# Altium schematic sheet 12-DPLL-01.SchDoc
size B; SheetNumber: 12; SheetTotal: 16
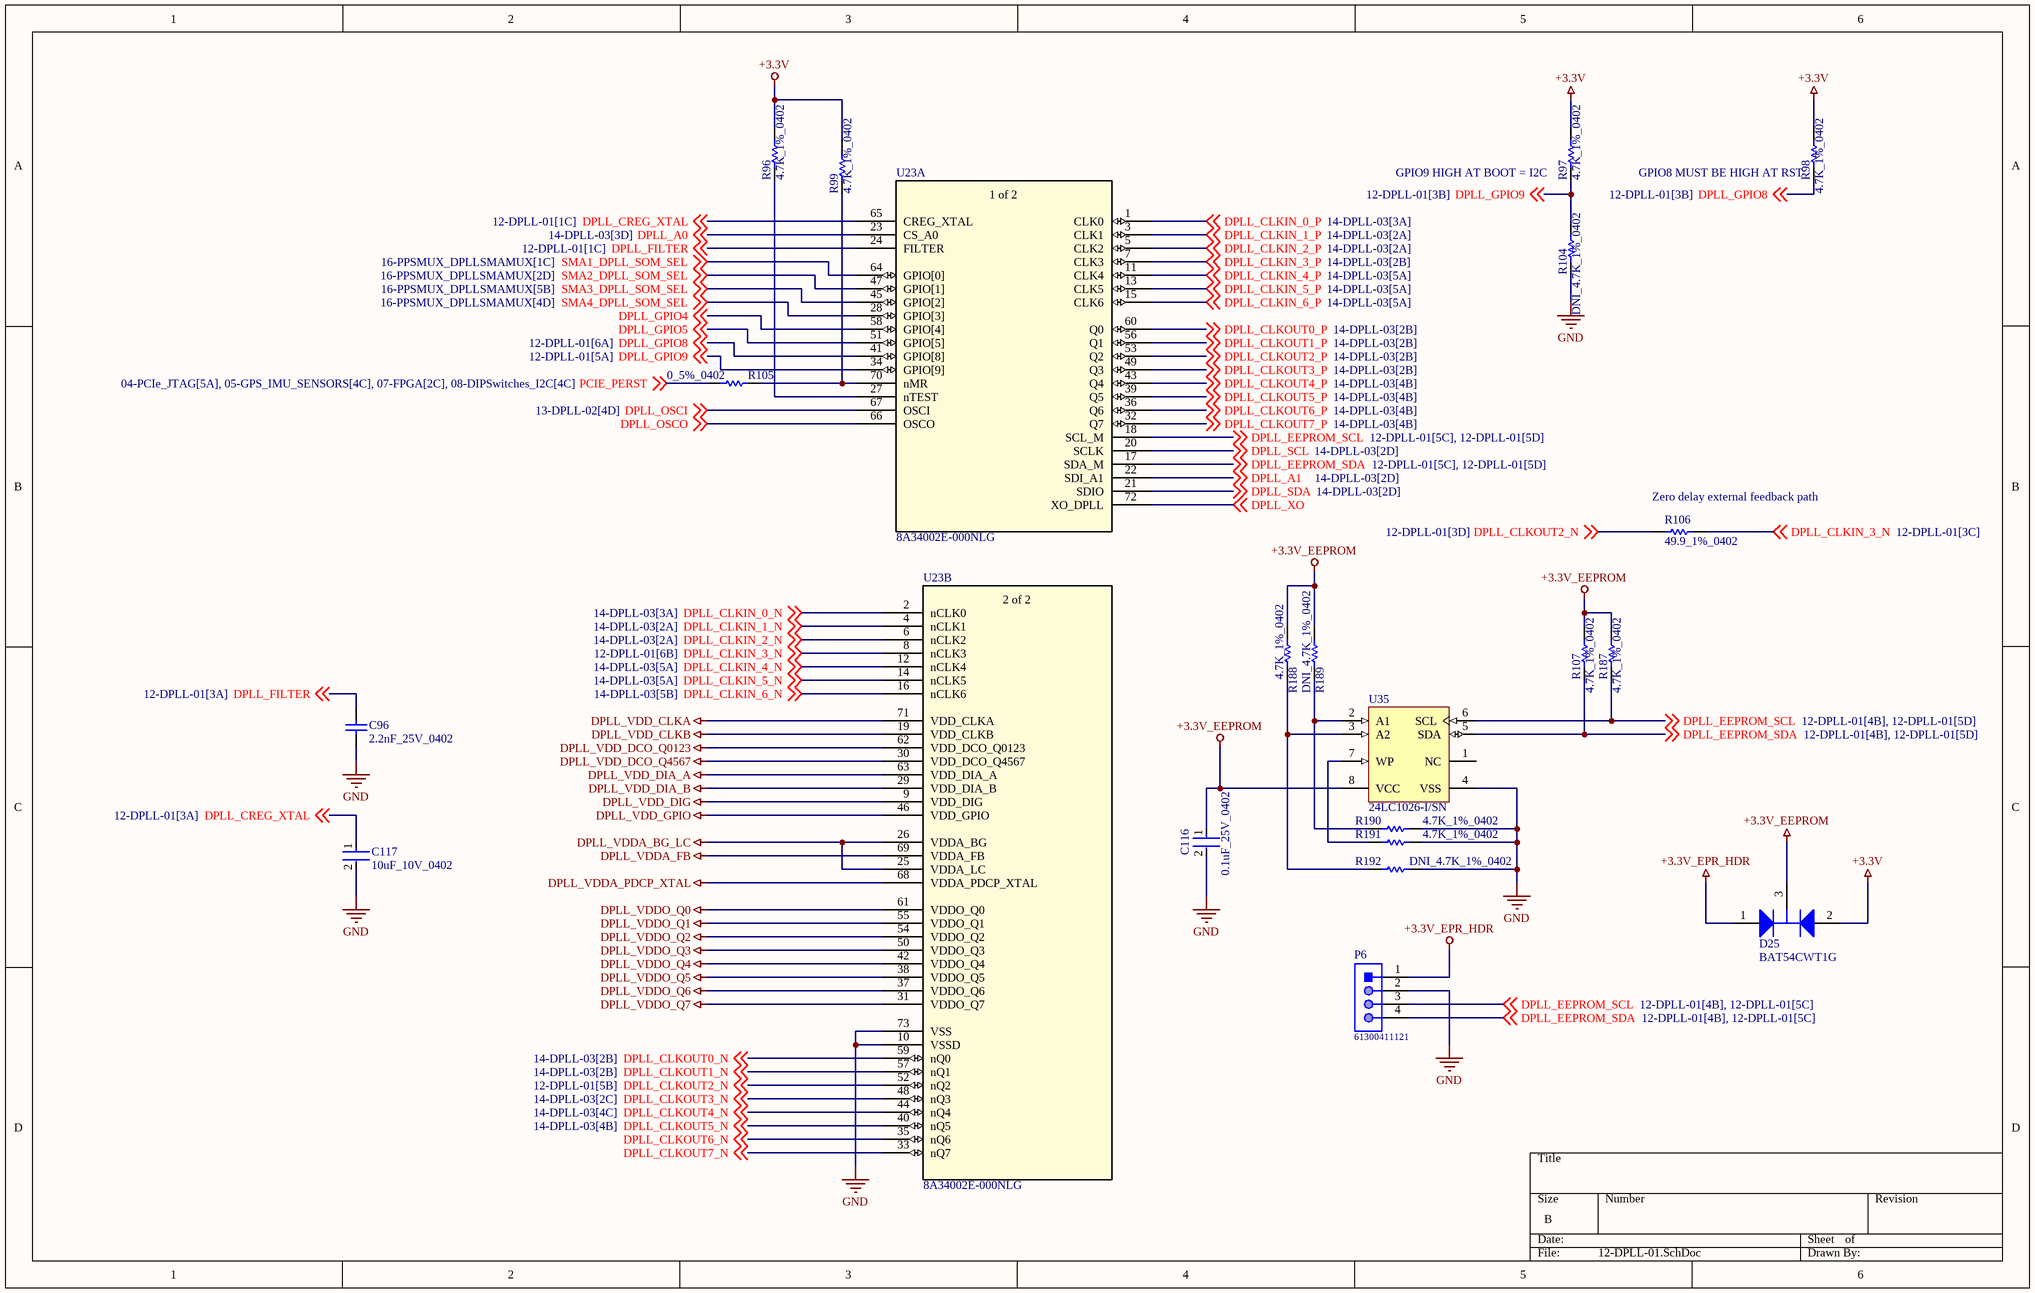
[diagram p0: 12-DPLL-01.SchDoc]

## Parts
C96  2.2nF_25V_0402  [CAPC1005X56X25LL10T15]
C116  0.1uF_25V_0402  [FP-0402-L_1_0_1-W_0_5_0_1-IPC_C]
C117  10uF_10V_0402  [FP-CL05A106MP5NUNC-MFG]
D25  BAT54CWT1G  [ONSC-SOT-323-3-419-04_V]
P6  61300411121  [61300411121]
R96  4.7K_1%_0402  [RESC1005X40X25NL10T10]
R97  4.7K_1%_0402  [RESC1005X40X25NL10T10]
R98  4.7K_1%_0402  [RESC1005X40X25NL10T10]
R99  4.7K_1%_0402  [RESC1005X40X25NL10T10]
R104  DNI_4.7K_1%_0402  [RESC1005X40X25NL10T10]  (no BOM)
R105  0_5%_0402  [RESC1005X40X25LL10T10]
R106  49.9_1%_0402  [RESC1005X40X25NL10T10]
R107  4.7K_1%_0402  [RESC1005X40X25NL10T10]
R187  4.7K_1%_0402  [RESC1005X40X25NL10T10]
R188  4.7K_1%_0402  [RESC1005X40X25NL10T10]
R189  DNI_4.7K_1%_0402  [RESC1005X40X25NL10T10]  (no BOM)
R190  4.7K_1%_0402  [RESC1005X40X25NL10T10]
R191  4.7K_1%_0402  [RESC1005X40X25NL10T10]
R192  DNI_4.7K_1%_0402  [RESC1005X40X25NL10T10]  (no BOM)
U23  8A34002E-000NLG  [QFN_2E-000NLG_REN]  (parts A,B of 2)
U35  24LC1026-I/SN  [MCHP-SOIC-SN8_N]

## Nets
+3.3V: D25.2(A2) R96.2 R97.1 R98.1 R99.2
+3.3V_EEPROM: C116.1 D25.3(K) R107.1 R187.1 R188.2 R189.2 U35.8(VCC)
+3.3V_EPR_HDR: D25.1(A1) P6.1
DPLL_VDD_CLKA: U23.71(VDD_CLKA)
DPLL_VDD_CLKB: U23.19(VDD_CLKB)
DPLL_VDD_DCO_Q0123: U23.62(VDD_DCO_Q0123)
DPLL_VDD_DCO_Q4567: U23.30(VDD_DCO_Q4567)
DPLL_VDD_DIA_A: U23.63(VDD_DIA_A)
DPLL_VDD_DIA_B: U23.29(VDD_DIA_B)
DPLL_VDD_DIG: U23.9(VDD_DIG)
DPLL_VDD_GPIO: U23.46(VDD_GPIO)
DPLL_VDDA_BG_LC: U23.25(VDDA_LC) U23.26(VDDA_BG)
DPLL_VDDA_FB: U23.69(VDDA_FB)
DPLL_VDDA_PDCP_XTAL: U23.68(VDDA_PDCP_XTAL)
DPLL_VDDO_Q0: U23.61(VDDO_Q0)
DPLL_VDDO_Q1: U23.55(VDDO_Q1)
DPLL_VDDO_Q2: U23.54(VDDO_Q2)
DPLL_VDDO_Q3: U23.50(VDDO_Q3)
DPLL_VDDO_Q4: U23.42(VDDO_Q4)
DPLL_VDDO_Q5: U23.38(VDDO_Q5)
DPLL_VDDO_Q6: U23.37(VDDO_Q6)
DPLL_VDDO_Q7: U23.31(VDDO_Q7)
GND: C96.1 C116.2 C117.2 P6.2 R104.2 R190.1 R191.1 R192.2 U23.10(VSSD) U23.73(VSS) U35.4(VSS)
DPLL_A0: U23.23(CS_A0) ; off-sheet DPLL_A0
DPLL_A1: U23.22(SDI_A1) ; off-sheet DPLL_A1
DPLL_CLKIN_0_N: U23.2(nCLK0) ; off-sheet DPLL_CLKIN_0_N
DPLL_CLKIN_0_P: U23.1(CLK0) ; off-sheet DPLL_CLKIN_0_P
DPLL_CLKIN_1_N: U23.4(nCLK1) ; off-sheet DPLL_CLKIN_1_N
DPLL_CLKIN_1_P: U23.3(CLK1) ; off-sheet DPLL_CLKIN_1_P
DPLL_CLKIN_2_N: U23.6(nCLK2) ; off-sheet DPLL_CLKIN_2_N
DPLL_CLKIN_2_P: U23.5(CLK2) ; off-sheet DPLL_CLKIN_2_P
DPLL_CLKIN_3_N: R106.2 U23.8(nCLK3) ; off-sheet DPLL_CLKIN_3_N
DPLL_CLKIN_3_P: U23.7(CLK3) ; off-sheet DPLL_CLKIN_3_P
DPLL_CLKIN_4_N: U23.12(nCLK4) ; off-sheet DPLL_CLKIN_4_N
DPLL_CLKIN_4_P: U23.11(CLK4) ; off-sheet DPLL_CLKIN_4_P
DPLL_CLKIN_5_N: U23.14(nCLK5) ; off-sheet DPLL_CLKIN_5_N
DPLL_CLKIN_5_P: U23.13(CLK5) ; off-sheet DPLL_CLKIN_5_P
DPLL_CLKIN_6_N: U23.16(nCLK6) ; off-sheet DPLL_CLKIN_6_N
DPLL_CLKIN_6_P: U23.15(CLK6) ; off-sheet DPLL_CLKIN_6_P
DPLL_CLKOUT0_N: U23.59(nQ0) ; off-sheet DPLL_CLKOUT0_N
DPLL_CLKOUT0_P: U23.60(Q0) ; off-sheet DPLL_CLKOUT0_P
DPLL_CLKOUT1_N: U23.57(nQ1) ; off-sheet DPLL_CLKOUT1_N
DPLL_CLKOUT1_P: U23.56(Q1) ; off-sheet DPLL_CLKOUT1_P
DPLL_CLKOUT2_N: R106.1 U23.52(nQ2) ; off-sheet DPLL_CLKOUT2_N
DPLL_CLKOUT2_P: U23.53(Q2) ; off-sheet DPLL_CLKOUT2_P
DPLL_CLKOUT3_N: U23.48(nQ3) ; off-sheet DPLL_CLKOUT3_N
DPLL_CLKOUT3_P: U23.49(Q3) ; off-sheet DPLL_CLKOUT3_P
DPLL_CLKOUT4_N: U23.44(nQ4) ; off-sheet DPLL_CLKOUT4_N
DPLL_CLKOUT4_P: U23.43(Q4) ; off-sheet DPLL_CLKOUT4_P
DPLL_CLKOUT5_N: U23.40(nQ5) ; off-sheet DPLL_CLKOUT5_N
DPLL_CLKOUT5_P: U23.39(Q5) ; off-sheet DPLL_CLKOUT5_P
DPLL_CLKOUT6_N: U23.35(nQ6) ; off-sheet DPLL_CLKOUT6_N
DPLL_CLKOUT6_P: U23.36(Q6) ; off-sheet DPLL_CLKOUT6_P
DPLL_CLKOUT7_N: U23.33(nQ7) ; off-sheet DPLL_CLKOUT7_N
DPLL_CLKOUT7_P: U23.32(Q7) ; off-sheet DPLL_CLKOUT7_P
DPLL_CREG_XTAL: C117.1 U23.65(CREG_XTAL) ; off-sheet DPLL_CREG_XTAL
DPLL_EEPROM_SCL: P6.3 R187.2 U23.18(SCL_M) U35.6(SCL) ; off-sheet DPLL_EEPROM_SCL
DPLL_EEPROM_SDA: P6.4 R107.2 U23.17(SDA_M) U35.5(SDA) ; off-sheet DPLL_EEPROM_SDA
DPLL_FILTER: C96.2 U23.24(FILTER) ; off-sheet DPLL_FILTER
DPLL_GPIO4: U23.58(GPIO[4]) ; off-sheet DPLL_GPIO4
DPLL_GPIO5: U23.51(GPIO[5]) ; off-sheet DPLL_GPIO5
DPLL_GPIO8: R98.2 U23.41(GPIO[8]) ; off-sheet DPLL_GPIO8
DPLL_GPIO9: R97.2 R104.1 U23.34(GPIO[9]) ; off-sheet DPLL_GPIO9
DPLL_OSCI: U23.67(OSCI) ; off-sheet DPLL_OSCI
DPLL_OSCO: U23.66(OSCO) ; off-sheet DPLL_OSCO
DPLL_SCL: U23.20(SCLK) ; off-sheet DPLL_SCL
DPLL_SDA: U23.21(SDIO) ; off-sheet DPLL_SDA
DPLL_XO: U23.72(XO_DPLL) ; off-sheet DPLL_XO
PCIE_PERST: R105.1 ; off-sheet PCIE_PERST
SMA1_DPLL_SOM_SEL: U23.64(GPIO[0]) ; off-sheet SMA1_DPLL_SOM_SEL
SMA2_DPLL_SOM_SEL: U23.47(GPIO[1]) ; off-sheet SMA2_DPLL_SOM_SEL
SMA3_DPLL_SOM_SEL: U23.45(GPIO[2]) ; off-sheet SMA3_DPLL_SOM_SEL
SMA4_DPLL_SOM_SEL: U23.28(GPIO[3]) ; off-sheet SMA4_DPLL_SOM_SEL
NetR96_1: R96.1 U23.27(nTEST)
NetR99_1: R99.1 R105.2 U23.70(nMR)
NetR188_1: R188.1 R192.1 U35.3(A2)
NetR189_1: R189.1 R190.2 U35.2(A1)
NetR191_2: R191.2 U35.7(WP)

Not connected (* = marked no-connect by the designer): U35 1(NC)

## Notes on the sheet
- (near R97) GPIO9 HIGH AT BOOT = I2C
- (near R98) GPIO8 MUST BE HIGH AT RST
- (near R106) Zero delay external feedback path
- (in symbol 8A34002E-000NLG, part A) 1 of 2
- (in symbol 8A34002E-000NLG, part B) 2 of 2

## Library data of the parts
C96 = CMP-2008-02907-1: Manufacturer: AVX Interconnect / Elco; Part Number: 04025C222JAT2A
C116 = CMP-2008-02519-2: General Purpose Ceramic Capacitor, 0402, 100nF, 10%, X7R, 15%, 25V; Package Quantity: 1; Capacitance: 100nF; Min Operating Temperature: -55°C; Voltage: 25V; Voltage Rating: 25V; Construction: Flat; Max Operating Temperature: 125°C; Radiation Hardening: No; Depth: 0.5mm; Thickness: 0.022inch; Voltage Rating (DC): 25V; Number of Pins: 2; Lead Free: Lead Free; Series: -; REACH SVHC: No SVHC; Length: 1mm; Dielectric: X7R; RoHS Compliant: Yes; Mount: Surface Mount; Packaging: Tape and Reel; Case/Package: 0402; Case Code (Imperial): 0402; Termination: SMD/SMT; Width: 0.02inch; Case Code (Metric): 1005; Tolerance: 10%
C117 = CMP-13271-000002-1: CAP CER 10UF 10V X5R 0402; Manufacturer Part Number: CL05A106MP5NUNC; Manufacturer: Samsung; Temperature Coefficient: 15%; Tolerance: 20%; Material: Ceramic; Octopart: https://octopart.com/cl05a106mp5nunc-samsung-22457395; Voltage Rating: 10V; RoHS: TRUE; Value: 10uF; Height: 0.7mm; Digikey Description: CAP CER 10UF 10V X5R 0402; Automotive: No; Package: CL05A106MP5NUNC; Device Class L1: Passive Components; Capacitance: 10uF; Temperature Range High: +85°C; ComponentLink2Description: Datasheet; Device Class L2: Capacitors; Temperature Characteristic: X5R; Temperature: -55°C to +85°C; ComponentLink2URL: http://www.samsungsem.com/kr/support/product-search/mlcc/__icsFiles/afieldfile/2019/05/10/19-CL05A106MP5NUNC.pdf; Device Class L3: Ceramic Capacitors; Category: Cap; Temperature Range Low: -55°C; Ipc Land Pattern Name: CAPC10050X50; Lead Free: Yes
D25 = CMP-1055-00557-1: Dual Series Cathode Schottky Barrier Diodes, 3-Pin SOT-323, Pb-Free, Tape and Reel; Manufacturer: On Semiconductor; Configuration: Common Cathode; IFSM Max (A): 0.6; trr Max (ns): 5; ComponentLink2Description: Datasheet; Packing: Tape and Reel; ComponentLink3Description: Package Specification; Mounting Technology: Surface Mount; PartNumber: BAT54CWT1G; PackageVersion: Rev. N, 11/2008; RoHS: TRUE; ComponentLink3URL: http://www.onsemi.com/pub_link/Collateral/419-04.PDF; ComponentLink2URL: http://www.onsemi.cn/pub_link/Collateral/BAT54CWT1-D.PDF; PackageReference: SOT-323-3-419-04; ComponentLink1URL: http://www.onsemi.com/; ComponentLink1Description: Manufacturer URL; DatasheetVersion: Rev. 7; PackageDescription: 3-Pin Small Outline Transistor, Body 2 x 1.25 mm, Pitch 0.65 mm
P6 = CMP-1502-01064-1: THT Vertical Pin Header WR-PHD, Pitch 2.54 mm, Single Row, 4 pins; Manufacturer: Wurth Elektronik; Withstanding Voltage: 500VAC; Rated Current: 3A; Working Voltage: 250VAC; Pin Number: 4; Gender: Male; Contact Resistance: 20mOhm; Pitch: 2.54mm; Manufacturer URL: http://www.we-online.de; Operating Temperature: -40to105degC; Packaging: Bag; Mounting Technology: THT; Package Reference: 61300411121; Datasheet URL: https://katalog.we-online.de/em/datasheet/6130xx11121.pdf; Publisher: WurthElektronik; Part Number: 61300411121; Row Number: Single; Orientation: Vertical
R96-R99 R104 R107 R187-R192 = CMP-2002-05217-1: Manufacturer: Bourns; Part Number: CR0402-FX-4701GLF
R105 = CMP-2002-04569-1: Manufacturer: KOA Speer; Part Number: RK73Z1ETTP
R106 = CMP-2002-04448-1: Part Number: RK73H1ETTP49R9F; Manufacturer: KOA Speer
U23 = 8A34002E-000NLG: No Description Available; Mfr_Name: Renesas Electronics; RefDes: RefDes; Type: Type
U35 = CMP-0159-01024-1: 1024K bits I2C™ Serial EEPROM, 2.5 to 5.5 V, 400 kHz, -40 to 85 degC, 8-pin SOIC (SN8), Tube; Manufacturer: Microchip; DatasheetVersion: Rev. C; ComponentLink3Description: Package Specification; ComponentLink1URL: http://www.microchip.com; Mounting Technology: Surface Mount; ComponentLink4URL: http://www.microchip.com/24LC1026; ComponentLink2Description: Datasheet; PartNumber: 24LC1026-I/SN; PackageReference: SOIC-SN8; PackageDescription: 8-Lead Plastic Small Outline, 4.9 x 3.9 mm Body, 1.27 mm Pitch; ComponentLink1Description: Manufacturer URL; ComponentLink3URL: http://www.microchip.com/stellent/groups/techpub_sg/documents/packagingspec/en012702.pdf; ComponentLink2URL: http://ww1.microchip.com/downloads/en/DeviceDoc/22270C.pdf; PackageVersion: C04-057C; ComponentLink4Description: Product URL